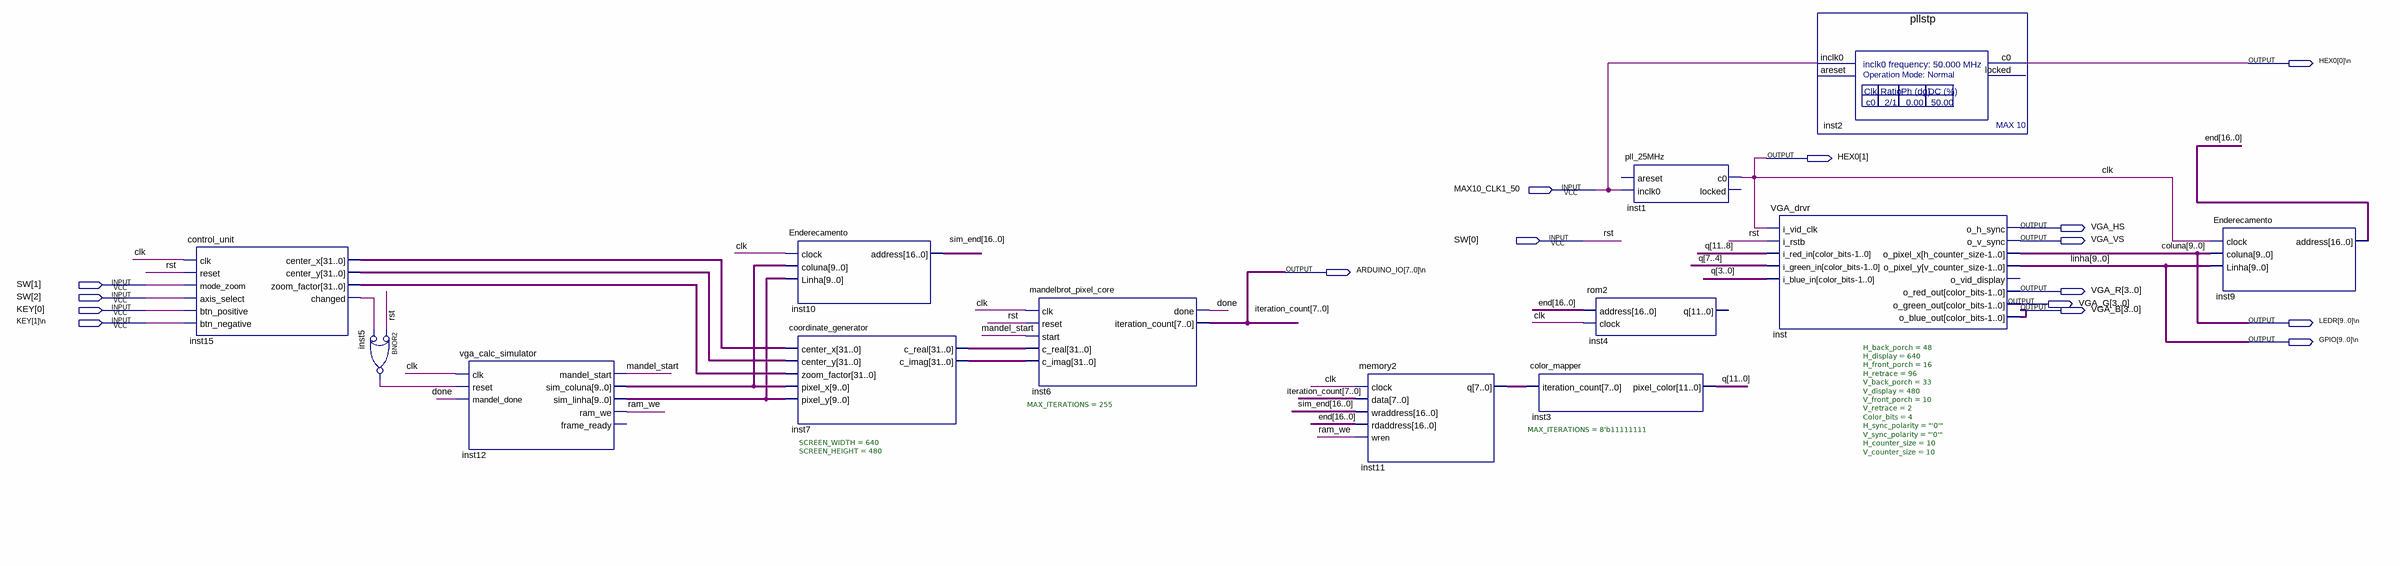
[diagram p0: schematic sheet]
// Quartus schematic vga1.bdf as structural Verilog: 13 symbols, 16 pins
module vga1 (
  input  MAX10_CLK1_50,
  input  [2:0] SW,
  input  [0:0] KEY,
  input  \KEY[1]\n ,
  output \HEX0[0]\n ,
  output [1:1] HEX0,
  output VGA_HS,
  output VGA_VS,
  output \ARDUINO_IO[7..0]\n ,
  output [3:0] VGA_R,
  output [3:0] VGA_G,
  output [3:0] VGA_B,
  output \LEDR[9..0]\n ,
  output \GPIO[9..0]\n 
);

  wire done, inst5_out, inst15_changed, mandel_start, ram_we;
  wire [7:0] inst11_q, iteration_count;
  wire [9:0] coluna, inst12_sim_coluna, inst12_sim_linha, linha;
  wire [11:0] q;
  wire [16:0] \end , sim_end;
  wire [31:0] inst7_c_imag, inst7_c_real, inst15_center_x, inst15_center_y, inst15_zoom_factor;

  control_unit inst15 (
    .clk(HEX0[1]), .reset(SW[0]), .mode_zoom(SW[1]), .axis_select(SW[2]), .btn_positive(KEY[0]),
    .btn_negative(\KEY[1]\n ), .center_x(inst15_center_x), .center_y(inst15_center_y),
    .zoom_factor(inst15_zoom_factor), .changed(inst15_changed));
  nor inst5 (inst5_out, ~SW[0], ~inst15_changed);  // BNOR2
  vga_calc_simulator inst12 (
    .clk(HEX0[1]), .reset(inst5_out), .mandel_done(done), .mandel_start(mandel_start),
    .sim_coluna(inst12_sim_coluna), .sim_linha(inst12_sim_linha), .ram_we(ram_we));  // open: frame_ready
  Enderecamento inst10 (.clock(HEX0[1]), .coluna(inst12_sim_coluna), .Linha(inst12_sim_linha), .address(sim_end));
  coordinate_generator #(.SCREEN_WIDTH(640), .SCREEN_HEIGHT(480)) inst7 (
    .center_x(inst15_center_x), .center_y(inst15_center_y), .zoom_factor(inst15_zoom_factor),
    .pixel_x(inst12_sim_coluna), .pixel_y(inst12_sim_linha), .c_real(inst7_c_real), .c_imag(inst7_c_imag));
  mandelbrot_pixel_core #(.MAX_ITERATIONS(255)) inst6 (
    .clk(HEX0[1]), .reset(SW[0]), .start(mandel_start), .c_real(inst7_c_real), .c_imag(inst7_c_imag),
    .done(done), .iteration_count(iteration_count));
  memory2 inst11 (
    .clock(HEX0[1]), .data(iteration_count), .wraddress(sim_end), .rdaddress(\end ), .wren(ram_we),
    .q(inst11_q));
  color_mapper #(.MAX_ITERATIONS(8'b11111111)) inst3 (.iteration_count(inst11_q), .pixel_color(q));
  rom2 inst4 (.address(\end ), .clock(HEX0[1]));  // open: q
  pll_25MHz inst1 (.inclk0(MAX10_CLK1_50), .c0(HEX0[1]));  // open: areset, locked
  VGA_drvr #(.H_back_porch(48), .H_display(640), .H_front_porch(16), .H_retrace(96), .V_back_porch(33), .V_display(480), .V_front_porch(10), .V_retrace(2), .Color_bits(4), .H_sync_polarity("'0'"), .V_sync_polarity("'0'"), .H_counter_size(10), .V_counter_size(10)) inst (
    .i_vid_clk(HEX0[1]), .i_rstb(SW[0]), .i_red_in(q[11:8]), .i_green_in(q[7:4]), .i_blue_in(q[3:0]),
    .o_h_sync(VGA_HS), .o_v_sync(VGA_VS), .o_pixel_x(coluna), .o_pixel_y(linha), .o_red_out(VGA_R),
    .o_green_out(VGA_G), .o_blue_out(VGA_B));  // open: o_vid_display
  pllstp inst2 (.inclk0(MAX10_CLK1_50), .c0(\HEX0[0]\n ));  // open: areset, locked
  Enderecamento inst9 (.clock(HEX0[1]), .coluna(coluna), .Linha(linha), .address(\end ));

  // Other names for the same wires on the sheet: clk = HEX0[1]; rst = SW[0]
endmodule
